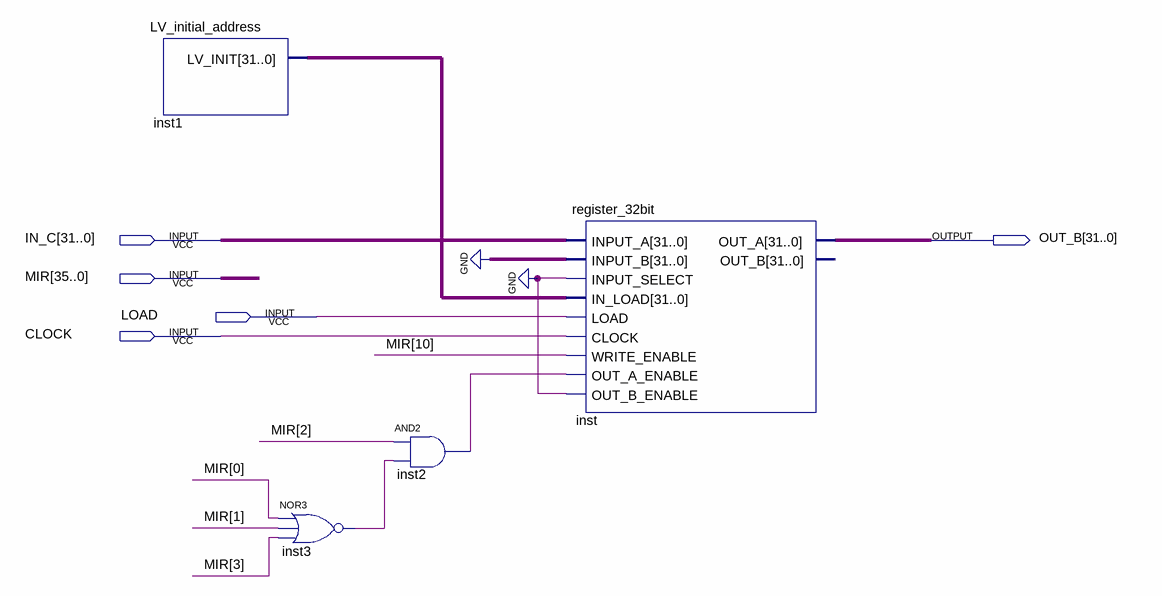
[diagram p0: schematic sheet]
// Quartus schematic SP.bdf as structural Verilog: 4 symbols, 5 pins
module SP (
  input  [31:0] IN_C,
  input  [35:0] MIR,
  input  LOAD,
  input  CLOCK,
  output [31:0] OUT_B
);

  wire inst2_out, inst3_out;
  wire [31:0] inst1_lv_init;

  LV_initial_address inst1 (.LV_INIT(inst1_lv_init));
  nor inst3 (inst3_out, MIR[0], MIR[1], MIR[3]);
  and inst2 (inst2_out, MIR[2], inst3_out);
  register_32bit inst (
    .INPUT_A(IN_C), .INPUT_B({32{1'b0}}), .INPUT_SELECT(1'b0), .IN_LOAD(inst1_lv_init), .LOAD(LOAD),
    .CLOCK(CLOCK), .WRITE_ENABLE(MIR[10]), .OUT_A_ENABLE(inst2_out), .OUT_B_ENABLE(1'b0), .OUT_A(OUT_B));  // open: OUT_B
endmodule
